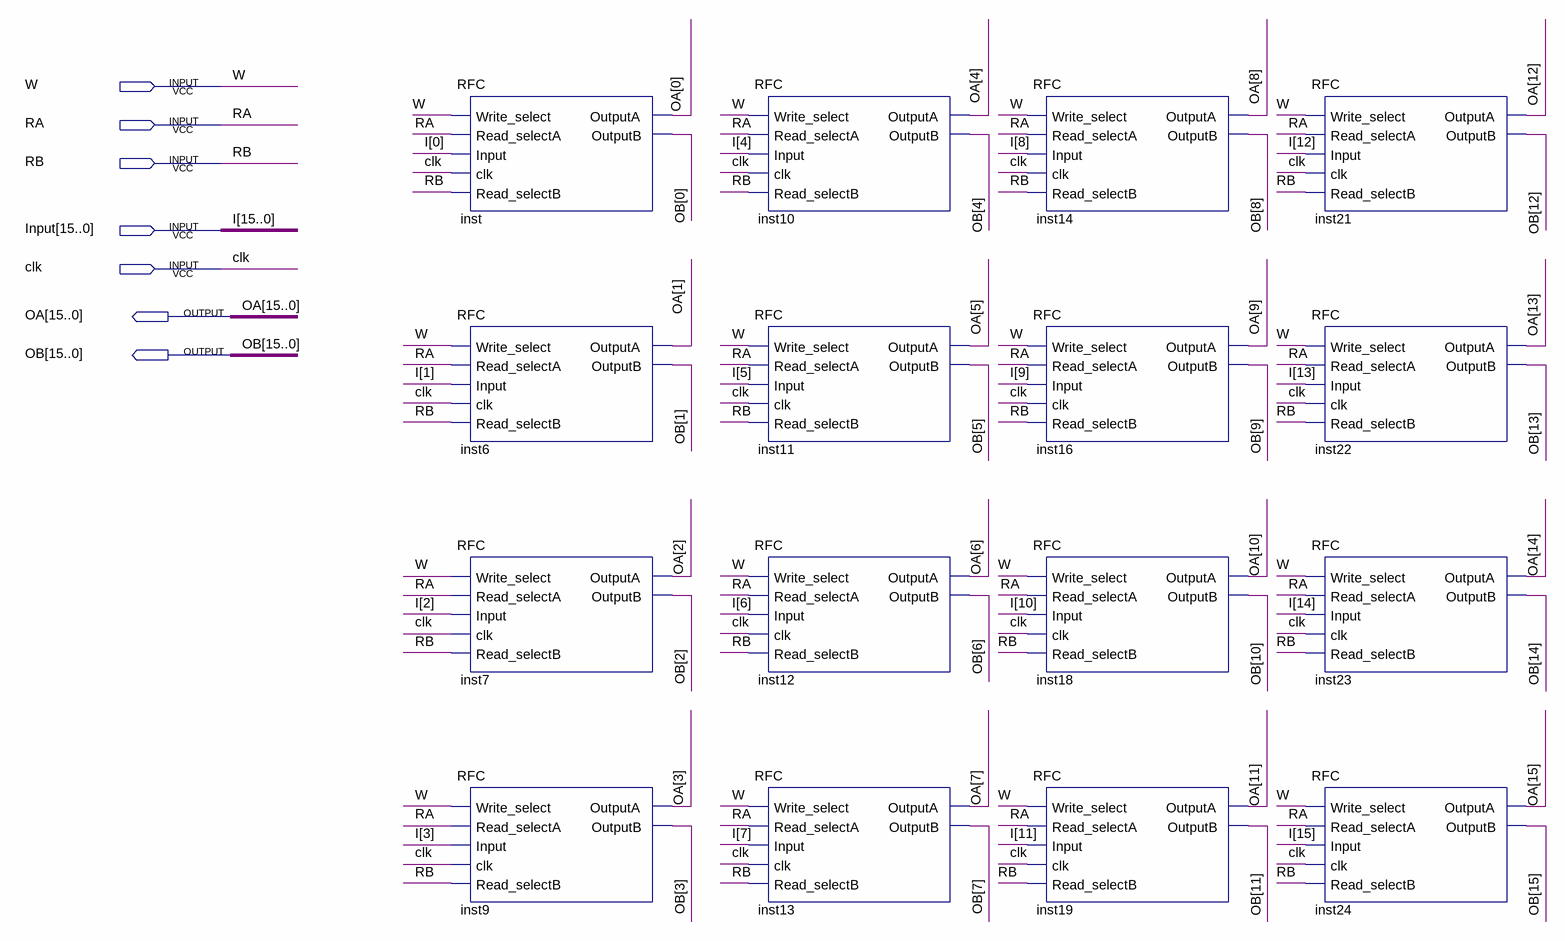
[diagram p0: schematic sheet]
// Quartus schematic RFC16bits.bdf as structural Verilog: 16 symbols, 7 pins
module RFC16bits (
  input  W,
  input  RA,
  input  RB,
  input  [15:0] Input,
  input  clk,
  output [15:0] OA,
  output [15:0] OB
);

  RFC inst (
    .Write_select(W), .Read_selectA(RA), .Input(Input[0]), .clk(clk), .Read_selectB(RB), .OutputA(OA[0]),
    .OutputB(OB[0]));
  RFC inst6 (
    .Write_select(W), .Read_selectA(RA), .Input(Input[1]), .clk(clk), .Read_selectB(RB), .OutputA(OA[1]),
    .OutputB(OB[1]));
  RFC inst7 (
    .Write_select(W), .Read_selectA(RA), .Input(Input[2]), .clk(clk), .Read_selectB(RB), .OutputA(OA[2]),
    .OutputB(OB[2]));
  RFC inst9 (
    .Write_select(W), .Read_selectA(RA), .Input(Input[3]), .clk(clk), .Read_selectB(RB), .OutputA(OA[3]),
    .OutputB(OB[3]));
  RFC inst10 (
    .Write_select(W), .Read_selectA(RA), .Input(Input[4]), .clk(clk), .Read_selectB(RB), .OutputA(OA[4]),
    .OutputB(OB[4]));
  RFC inst11 (
    .Write_select(W), .Read_selectA(RA), .Input(Input[5]), .clk(clk), .Read_selectB(RB), .OutputA(OA[5]),
    .OutputB(OB[5]));
  RFC inst12 (
    .Write_select(W), .Read_selectA(RA), .Input(Input[6]), .clk(clk), .Read_selectB(RB), .OutputA(OA[6]),
    .OutputB(OB[6]));
  RFC inst13 (
    .Write_select(W), .Read_selectA(RA), .Input(Input[7]), .clk(clk), .Read_selectB(RB), .OutputA(OA[7]),
    .OutputB(OB[7]));
  RFC inst14 (
    .Write_select(W), .Read_selectA(RA), .Input(Input[8]), .clk(clk), .Read_selectB(RB), .OutputA(OA[8]),
    .OutputB(OB[8]));
  RFC inst16 (
    .Write_select(W), .Read_selectA(RA), .Input(Input[9]), .clk(clk), .Read_selectB(RB), .OutputA(OA[9]),
    .OutputB(OB[9]));
  RFC inst18 (
    .Write_select(W), .Read_selectA(RA), .Input(Input[10]), .clk(clk), .Read_selectB(RB), .OutputA(OA[10]),
    .OutputB(OB[10]));
  RFC inst19 (
    .Write_select(W), .Read_selectA(RA), .Input(Input[11]), .clk(clk), .Read_selectB(RB), .OutputA(OA[11]),
    .OutputB(OB[11]));
  RFC inst21 (
    .Write_select(W), .Read_selectA(RA), .Input(Input[12]), .clk(clk), .Read_selectB(RB), .OutputA(OA[12]),
    .OutputB(OB[12]));
  RFC inst22 (
    .Write_select(W), .Read_selectA(RA), .Input(Input[13]), .clk(clk), .Read_selectB(RB), .OutputA(OA[13]),
    .OutputB(OB[13]));
  RFC inst23 (
    .Write_select(W), .Read_selectA(RA), .Input(Input[14]), .clk(clk), .Read_selectB(RB), .OutputA(OA[14]),
    .OutputB(OB[14]));
  RFC inst24 (
    .Write_select(W), .Read_selectA(RA), .Input(Input[15]), .clk(clk), .Read_selectB(RB), .OutputA(OA[15]),
    .OutputB(OB[15]));

  // Other names for the same wires on the sheet: I[15:0] = Input
endmodule
